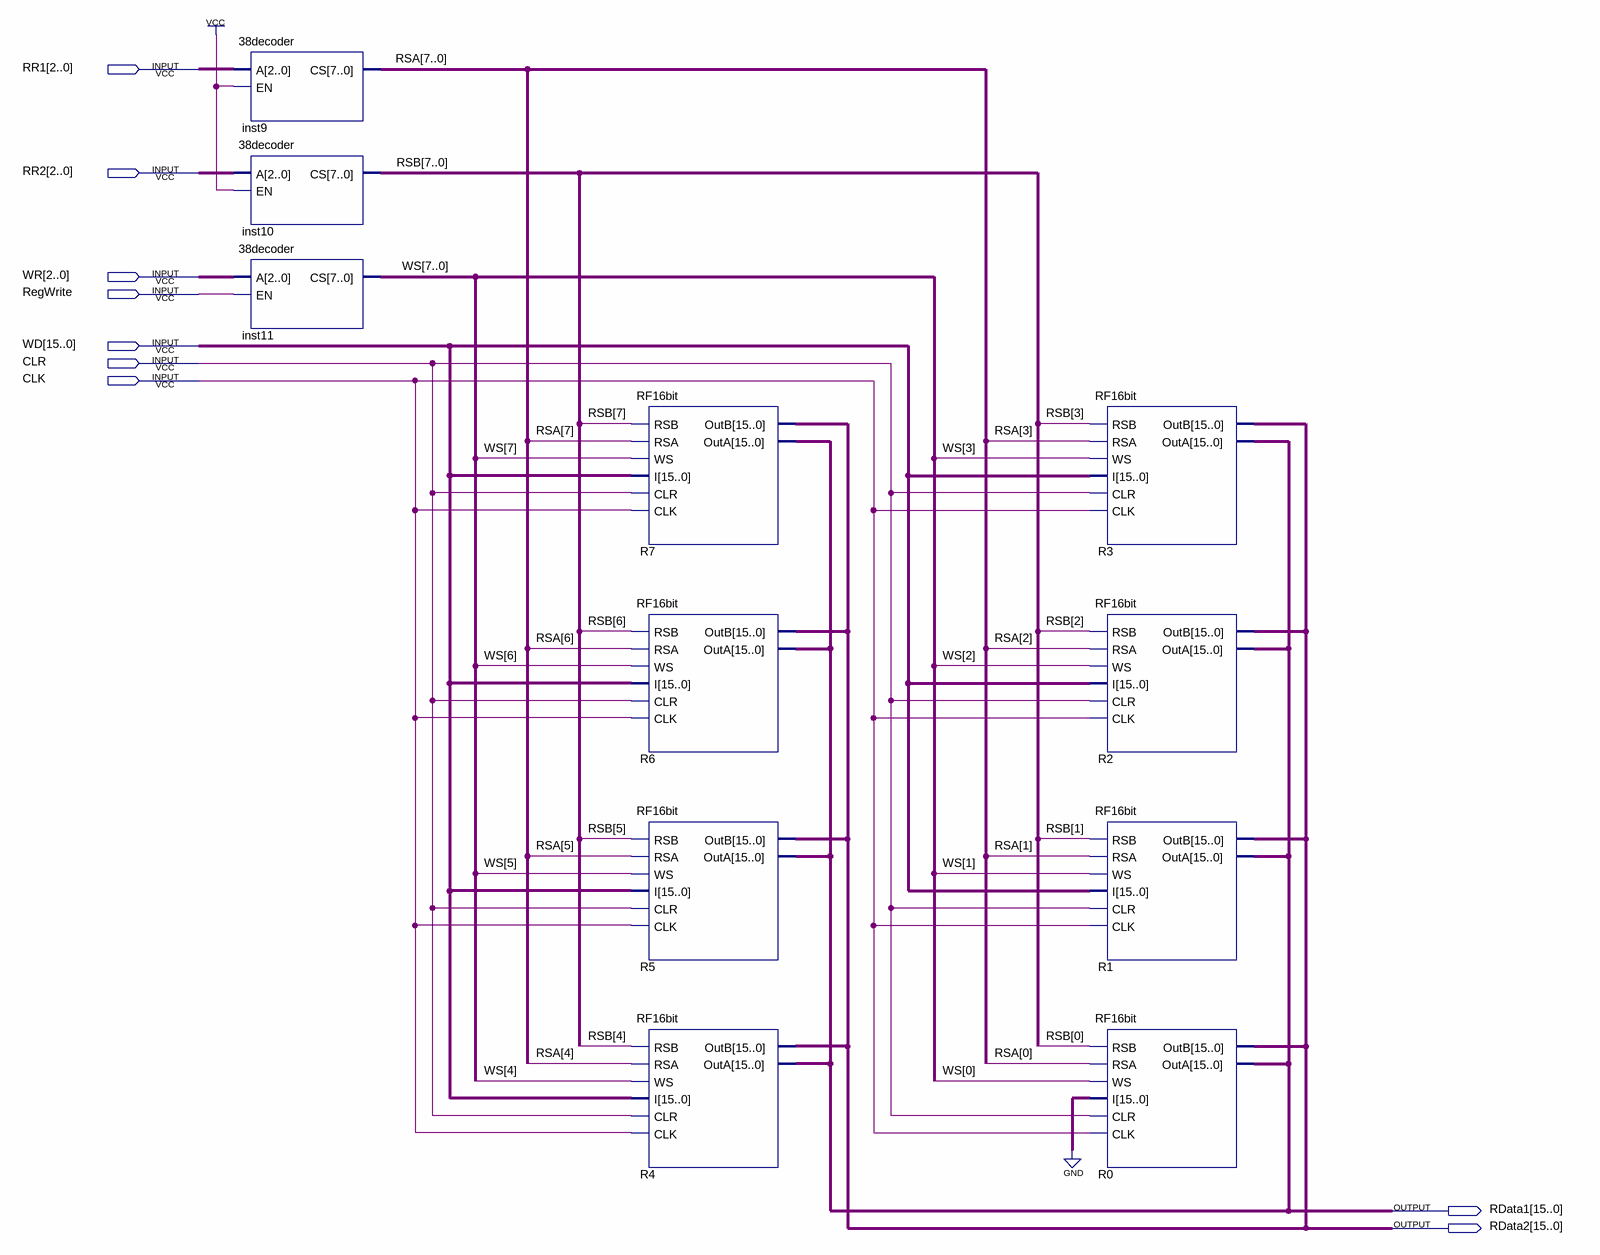
[diagram p0: schematic sheet]
// Quartus schematic Register.bdf as structural Verilog: 11 symbols, 9 pins
module Register (
  input  [2:0] RR1,
  input  [2:0] RR2,
  input  [2:0] WR,
  input  RegWrite,
  input  [15:0] WD,
  input  CLR,
  input  CLK,
  output [15:0] RData1,
  output [15:0] RData2
);

  wire [7:0] RSA, RSB, WS;

  \38decoder  inst9 (.A(RR1), .EN(1'b1), .CS(RSA));
  \38decoder  inst10 (.A(RR2), .EN(1'b1), .CS(RSB));
  \38decoder  inst11 (.A(WR), .EN(RegWrite), .CS(WS));
  RF16bit R7 (.RSB(RSB[7]), .RSA(RSA[7]), .WS(WS[7]), .I(WD), .CLR(CLR), .CLK(CLK), .OutB(RData2), .OutA(RData1));
  RF16bit R6 (.RSB(RSB[6]), .RSA(RSA[6]), .WS(WS[6]), .I(WD), .CLR(CLR), .CLK(CLK), .OutB(RData2), .OutA(RData1));
  RF16bit R5 (.RSB(RSB[5]), .RSA(RSA[5]), .WS(WS[5]), .I(WD), .CLR(CLR), .CLK(CLK), .OutB(RData2), .OutA(RData1));
  RF16bit R4 (.RSB(RSB[4]), .RSA(RSA[4]), .WS(WS[4]), .I(WD), .CLR(CLR), .CLK(CLK), .OutB(RData2), .OutA(RData1));
  RF16bit R3 (.RSB(RSB[3]), .RSA(RSA[3]), .WS(WS[3]), .I(WD), .CLR(CLR), .CLK(CLK), .OutB(RData2), .OutA(RData1));
  RF16bit R2 (.RSB(RSB[2]), .RSA(RSA[2]), .WS(WS[2]), .I(WD), .CLR(CLR), .CLK(CLK), .OutB(RData2), .OutA(RData1));
  RF16bit R1 (.RSB(RSB[1]), .RSA(RSA[1]), .WS(WS[1]), .I(WD), .CLR(CLR), .CLK(CLK), .OutB(RData2), .OutA(RData1));
  RF16bit R0 (
    .RSB(RSB[0]), .RSA(RSA[0]), .WS(WS[0]), .I({16{1'b0}}), .CLR(CLR), .CLK(CLK), .OutB(RData2), .OutA(RData1));
endmodule
